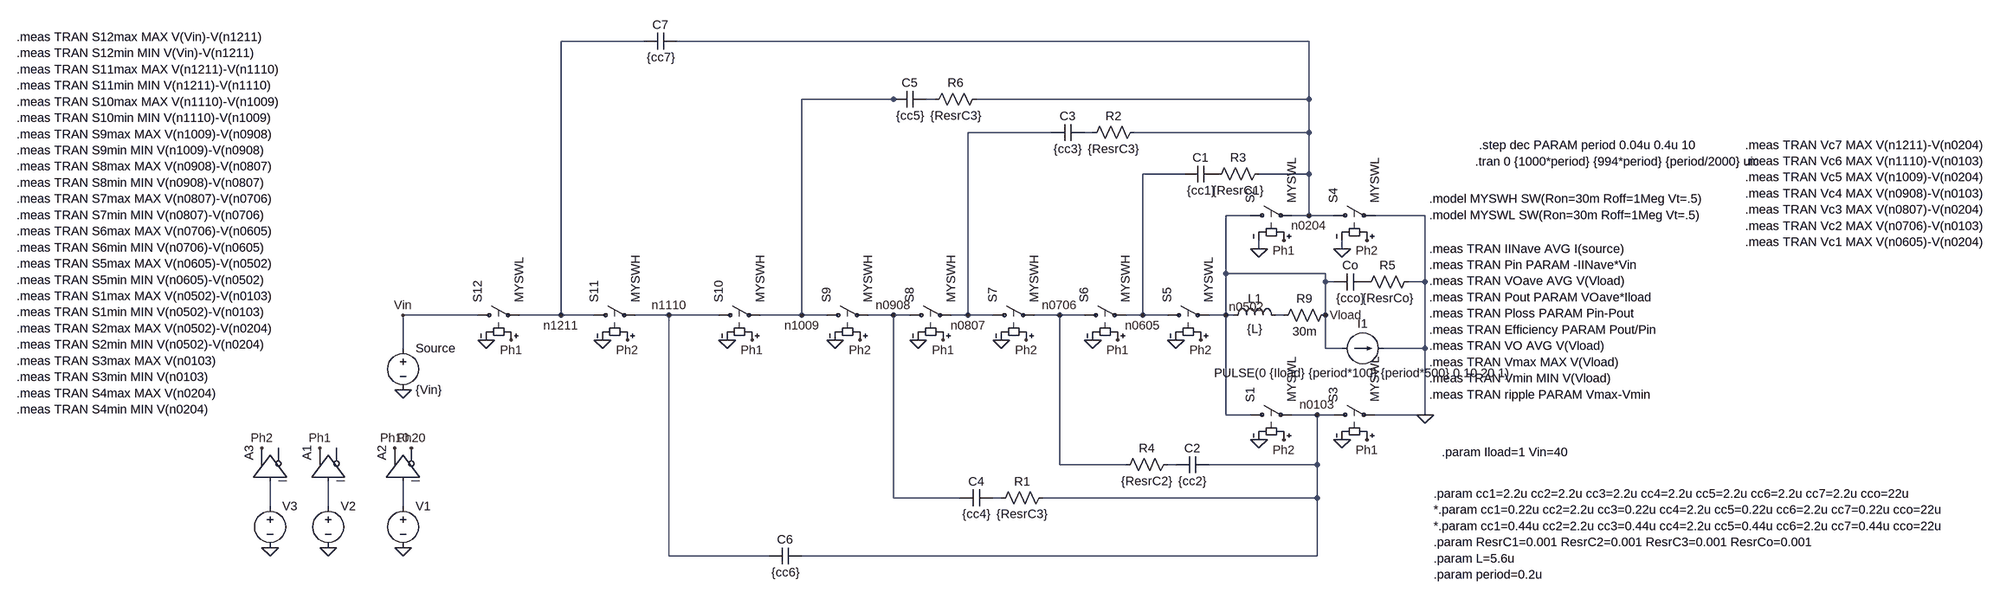
[diagram p0: schematic 8to1_dickson_two_phase.asc]
8to1_dickson_two_phase.asc, the LTspice schematic file:
Version 4
SHEET 1 1904 1156
WIRE -832 -448 -992 -448
WIRE 448 -448 -768 -448
WIRE -352 -336 -528 -336
WIRE -336 -336 -352 -336
WIRE -272 -336 -288 -336
WIRE 448 -336 448 -448
WIRE 448 -336 -192 -336
WIRE -48 -272 -208 -272
WIRE 32 -272 16 -272
WIRE 448 -272 448 -336
WIRE 448 -272 112 -272
WIRE 208 -192 128 -192
WIRE 448 -192 448 -272
WIRE 448 -192 352 -192
WIRE 336 -112 288 -112
WIRE 448 -112 448 -192
WIRE 448 -112 416 -112
WIRE 496 -112 448 -112
WIRE 672 -112 576 -112
WIRE 352 -48 352 -64
WIRE 512 -48 512 -64
WIRE 288 0 288 -112
WIRE 480 0 288 0
WIRE 480 16 480 0
WIRE 496 16 480 16
WIRE 672 16 672 -112
WIRE 672 16 640 16
WIRE -1152 80 -1296 80
WIRE -992 80 -992 -448
WIRE -992 80 -1072 80
WIRE -928 80 -992 80
WIRE -784 80 -848 80
WIRE -688 80 -784 80
WIRE -528 80 -528 -336
WIRE -528 80 -608 80
WIRE -480 80 -528 80
WIRE -352 80 -400 80
WIRE -320 80 -352 80
WIRE -208 80 -208 -272
WIRE -208 80 -240 80
WIRE -160 80 -208 80
WIRE -32 80 -80 80
WIRE 16 80 -32 80
WIRE 128 80 128 -192
WIRE 128 80 96 80
WIRE 176 80 128 80
WIRE 288 80 288 0
WIRE 288 80 256 80
WIRE 304 80 288 80
WIRE 400 80 384 80
WIRE 480 80 480 16
WIRE -1296 144 -1296 80
WIRE 480 144 480 80
WIRE 512 144 480 144
WIRE 672 144 672 16
WIRE 672 144 592 144
WIRE 288 272 288 80
WIRE 336 272 288 272
WIRE 464 272 416 272
WIRE 496 272 464 272
WIRE 672 272 672 144
WIRE 672 272 576 272
WIRE -32 368 -32 80
WIRE 96 368 -32 368
WIRE 192 368 176 368
WIRE 464 368 464 272
WIRE 464 368 256 368
WIRE -352 432 -352 80
WIRE -224 432 -352 432
WIRE -144 432 -160 432
WIRE 464 432 464 368
WIRE 464 432 -64 432
WIRE -1552 448 -1552 400
WIRE -1440 448 -1440 400
WIRE -1296 448 -1296 400
WIRE -784 544 -784 80
WIRE -592 544 -784 544
WIRE 464 544 464 432
WIRE 464 544 -528 544
FLAG -1440 528 0
FLAG -1456 336 Ph1
FLAG -1296 224 0
FLAG -256 128 Ph1
FLAG 80 128 Ph1
FLAG 400 -64 Ph1
FLAG 560 320 Ph1
FLAG -96 128 Ph2
FLAG 240 128 Ph2
FLAG 560 -64 Ph2
FLAG 400 320 Ph2
FLAG -304 128 0
FLAG -144 128 0
FLAG 32 128 0
FLAG 192 128 0
FLAG 352 -48 0
FLAG 352 320 0
FLAG 512 -48 0
FLAG 512 320 0
FLAG -1296 80 Vin
FLAG -416 128 Ph2
FLAG -464 128 0
FLAG -624 128 Ph1
FLAG -864 128 Ph2
FLAG -1088 128 Ph1
FLAG -1136 128 0
FLAG -912 128 0
FLAG -672 128 0
FLAG 480 80 Vload
FLAG 672 272 0
FLAG -1296 528 0
FLAG -1312 336 Ph10
FLAG -1280 336 Ph20
FLAG -1552 528 0
FLAG -1568 336 Ph2
FLAG -784 80 n1110
FLAG -992 80 n1211
FLAG -528 80 n1009
FLAG -352 80 n0908
FLAG -208 80 n0807
FLAG -32 80 n0706
FLAG 128 80 n0605
FLAG 288 80 n0502
FLAG 464 272 n0103
FLAG 448 -112 n0204
SYMBOL voltage -1440 432 R0
WINDOW 123 0 0 Left 2
WINDOW 39 0 0 Left 2
WINDOW 3 24 96 Invisible 2
SYMATTR Value PULSE(0 1 0 1p 1p {period/2-1p} {period})
SYMATTR InstName V2
SYMBOL Digital\\buf -1504 400 R270
SYMATTR InstName A1
SYMBOL voltage -1296 128 R0
WINDOW 123 0 0 Left 2
WINDOW 39 0 0 Left 2
SYMATTR InstName Source
SYMATTR Value {Vin}
SYMBOL sw -336 80 R270
SYMATTR InstName S8
SYMATTR Value MYSWH
SYMBOL sw -176 80 R270
SYMATTR InstName S7
SYMATTR Value MYSWH
SYMBOL sw 0 80 R270
SYMATTR InstName S6
SYMATTR Value MYSWH
SYMBOL sw 160 80 R270
SYMATTR InstName S5
SYMATTR Value MYSWL
SYMBOL sw 320 -112 R270
SYMATTR InstName S2
SYMATTR Value MYSWL
SYMBOL sw 480 -112 R270
SYMATTR InstName S4
SYMATTR Value MYSWL
SYMBOL sw 480 272 R270
SYMATTR InstName S3
SYMATTR Value MYSWL
SYMBOL sw 320 272 R270
SYMATTR InstName S1
SYMATTR Value MYSWL
SYMBOL cap -48 -256 R270
WINDOW 0 32 32 VTop 2
WINDOW 3 0 32 VBottom 2
SYMATTR InstName C3
SYMATTR Value {cc3}
SYMATTR SpiceLine ic={Vin/8*3}
SYMBOL cap 208 -176 R270
WINDOW 0 32 32 VTop 2
WINDOW 3 0 32 VBottom 2
SYMATTR InstName C1
SYMATTR Value {cc1}
SYMATTR SpiceLine ic={Vin/8*1}
SYMBOL cap 192 384 R270
WINDOW 0 32 32 VTop 2
WINDOW 3 0 32 VBottom 2
SYMATTR InstName C2
SYMATTR Value {cc2}
SYMATTR SpiceLine ic={Vin/8*2}
SYMBOL cap 496 32 R270
WINDOW 0 32 32 VTop 2
WINDOW 3 0 32 VBottom 2
SYMATTR InstName Co
SYMATTR Value {cco}
SYMBOL res 16 -256 R270
WINDOW 0 32 56 VTop 2
WINDOW 3 0 56 VBottom 2
SYMATTR InstName R2
SYMATTR Value {ResrC3}
SYMBOL res 256 -176 R270
WINDOW 0 32 56 VTop 2
WINDOW 3 0 56 VBottom 2
SYMATTR InstName R3
SYMATTR Value {ResrC1}
SYMBOL res 80 384 R270
WINDOW 0 32 56 VTop 2
WINDOW 3 0 56 VBottom 2
SYMATTR InstName R4
SYMATTR Value {ResrC2}
SYMBOL res 544 32 R270
WINDOW 0 32 56 VTop 2
WINDOW 3 0 56 VBottom 2
SYMATTR InstName R5
SYMATTR Value {ResrCo}
SYMBOL current 512 144 R270
WINDOW 0 32 40 VTop 2
WINDOW 3 -32 40 VBottom 2
WINDOW 123 0 0 Left 2
WINDOW 39 0 0 Left 2
SYMATTR InstName I1
SYMATTR Value PULSE(0 {Iload} {period*100} {period*500} 0 10 20 1)
SYMBOL cap -224 448 R270
WINDOW 0 32 32 VTop 2
WINDOW 3 0 32 VBottom 2
SYMATTR InstName C4
SYMATTR Value {cc4}
SYMATTR SpiceLine ic={Vin/8*4}
SYMBOL res -160 448 R270
WINDOW 0 32 56 VTop 2
WINDOW 3 0 56 VBottom 2
SYMATTR InstName R1
SYMATTR Value {ResrC3}
SYMBOL sw -496 80 R270
SYMATTR InstName S9
SYMATTR Value MYSWH
SYMBOL cap -352 -320 R270
WINDOW 0 32 32 VTop 2
WINDOW 3 0 32 VBottom 2
SYMATTR InstName C5
SYMATTR Value {cc5}
SYMATTR SpiceLine ic={Vin/8*5}
SYMBOL res -288 -320 R270
WINDOW 0 32 56 VTop 2
WINDOW 3 0 56 VBottom 2
SYMATTR InstName R6
SYMATTR Value {ResrC3}
SYMBOL cap -592 560 R270
WINDOW 0 32 32 VTop 2
WINDOW 3 0 32 VBottom 2
SYMATTR InstName C6
SYMATTR Value {cc6}
SYMATTR SpiceLine Rser=7m
SYMATTR SpiceLine2 ic={Vin/8*6}
SYMBOL cap -832 -432 R270
WINDOW 0 32 32 VTop 2
WINDOW 3 0 32 VBottom 2
SYMATTR InstName C7
SYMATTR Value {cc7}
SYMATTR SpiceLine Rser=7m
SYMATTR SpiceLine2 ic={Vin/8*7}
SYMBOL sw -704 80 R270
SYMATTR InstName S10
SYMATTR Value MYSWH
SYMBOL sw -944 80 R270
SYMATTR InstName S11
SYMATTR Value MYSWH
SYMBOL sw -1168 80 R270
SYMATTR InstName S12
SYMATTR Value MYSWL
SYMBOL ind 288 96 R270
WINDOW 0 32 56 VTop 2
WINDOW 3 5 56 VBottom 2
SYMATTR InstName L1
SYMATTR Value {L}
SYMATTR SpiceLine Rser=0
SYMBOL res 496 64 R90
WINDOW 0 0 56 VBottom 2
WINDOW 3 32 56 VTop 2
SYMATTR InstName R9
SYMATTR Value 30m
SYMBOL voltage -1296 432 R0
WINDOW 123 0 0 Left 2
WINDOW 39 0 0 Left 2
WINDOW 3 24 96 Invisible 2
SYMATTR Value PULSE(0 1 0 1n 1n {period/2-1n} {period})
SYMATTR InstName V1
SYMBOL Digital\\buf -1360 400 R270
SYMATTR InstName A2
SYMBOL voltage -1552 432 R0
WINDOW 123 0 0 Left 2
WINDOW 39 0 0 Left 2
WINDOW 3 24 96 Invisible 2
SYMATTR Value PULSE(0 1 {period/2} 1p 1p {period/2-1p} {period})
SYMATTR InstName V3
SYMBOL Digital\\buf -1616 400 R270
SYMATTR InstName A3
TEXT 768 -216 Left 2 !.tran 0 {1000*period} {994*period} {period/2000} uic
TEXT 680 -144 Left 2 !.model MYSWH SW(Ron=30m Roff=1Meg Vt=.5)\n.model MYSWL SW(Ron=30m Roff=1Meg Vt=.5)
TEXT 680 -48 Left 2 !.meas TRAN IINave AVG I(source)\n.meas TRAN Pin PARAM -IINave*Vin\n.meas TRAN VOave AVG V(Vload)\n.meas TRAN Pout PARAM VOave*Iload\n.meas TRAN Ploss PARAM Pin-Pout\n.meas TRAN Efficiency PARAM Pout/Pin\n.meas TRAN VO AVG V(Vload)\n.meas TRAN Vmax MAX V(Vload)\n.meas TRAN Vmin MIN V(Vload)\n.meas TRAN ripple PARAM Vmax-Vmin
TEXT 688 424 Left 2 !.param cc1=2.2u cc2=2.2u cc3=2.2u cc4=2.2u cc5=2.2u cc6=2.2u cc7=2.2u cco=22u\n*.param cc1=0.22u cc2=2.2u cc3=0.22u cc4=2.2u cc5=0.22u cc6=2.2u cc7=0.22u cco=22u\n*.param cc1=0.44u cc2=2.2u cc3=0.44u cc4=2.2u cc5=0.44u cc6=2.2u cc7=0.44u cco=22u\n.param ResrC1=0.001 ResrC2=0.001 ResrC3=0.001 ResrCo=0.001\n.param L=5.6u\n.param period=0.2u
TEXT 776 -248 Left 2 !.step dec PARAM period 0.04u 0.4u 10
TEXT 1288 -248 Left 2 !.meas TRAN Vc7 MAX V(n1211)-V(n0204)\n.meas TRAN Vc6 MAX V(n1110)-V(n0103)\n.meas TRAN Vc5 MAX V(n1009)-V(n0204)\n.meas TRAN Vc4 MAX V(n0908)-V(n0103)\n.meas TRAN Vc3 MAX V(n0807)-V(n0204)\n.meas TRAN Vc2 MAX V(n0706)-V(n0103)\n.meas TRAN Vc1 MAX V(n0605)-V(n0204)
TEXT -2040 -456 Left 2 !.meas TRAN S12max MAX V(Vin)-V(n1211)\n.meas TRAN S12min MIN V(Vin)-V(n1211)\n.meas TRAN S11max MAX V(n1211)-V(n1110)\n.meas TRAN S11min MIN V(n1211)-V(n1110)\n.meas TRAN S10max MAX V(n1110)-V(n1009)\n.meas TRAN S10min MIN V(n1110)-V(n1009)\n.meas TRAN S9max MAX V(n1009)-V(n0908)\n.meas TRAN S9min MIN V(n1009)-V(n0908)\n.meas TRAN S8max MAX V(n0908)-V(n0807)\n.meas TRAN S8min MIN V(n0908)-V(n0807)\n.meas TRAN S7max MAX V(n0807)-V(n0706)\n.meas TRAN S7min MIN V(n0807)-V(n0706)\n.meas TRAN S6max MAX V(n0706)-V(n0605)\n.meas TRAN S6min MIN V(n0706)-V(n0605)\n.meas TRAN S5max MAX V(n0605)-V(n0502)\n.meas TRAN S5min MIN V(n0605)-V(n0502)\n.meas TRAN S1max MAX V(n0502)-V(n0103)\n.meas TRAN S1min MIN V(n0502)-V(n0103)\n.meas TRAN S2max MAX V(n0502)-V(n0204)\n.meas TRAN S2min MIN V(n0502)-V(n0204)\n.meas TRAN S3max MAX V(n0103)\n.meas TRAN S3min MIN V(n0103)\n.meas TRAN S4max MAX V(n0204)\n.meas TRAN S4min MIN V(n0204)
TEXT 704 344 Left 2 !.param Iload=1 Vin=40

The netlist it stands for:
* 8to1_dickson_two_phase.asc
V2 N007 0 PULSE(0 1 0 1p 1p {period/2-1p} {period})
A1 N007 0 0 0 0 0 Ph1 0 BUF
V§Source Vin 0 {Vin}
S8 n0908 n0807 Ph1 0 MYSWH
S7 n0807 n0706 Ph2 0 MYSWH
S6 n0706 n0605 Ph1 0 MYSWH
S5 n0605 n0502 Ph2 0 MYSWL
S2 n0502 n0204 Ph1 0 MYSWL
S4 n0204 0 Ph2 0 MYSWL
S3 n0103 0 Ph1 0 MYSWL
S1 n0502 n0103 Ph2 0 MYSWL
C3 n0807 N002 {cc3} ic={Vin/8*3}
C1 n0605 P001 {cc1} ic={Vin/8*1}
C2 N004 n0103 {cc2} ic={Vin/8*2}
Co n0502 P002 {cco}
R2 N002 n0204 {ResrC3}
R3 P001 n0204 {ResrC1}
R4 n0706 N004 {ResrC2}
R5 P002 0 {ResrCo}
I1 n0502 0 PULSE(0 {Iload} {period*100} {period*500} 0 10 20 1)
C4 n0908 N005 {cc4} ic={Vin/8*4}
R1 N005 n0103 {ResrC3}
S9 n1009 n0908 Ph2 0 MYSWH
C5 n1009 N001 {cc5} ic={Vin/8*5}
R6 N001 n0204 {ResrC3}
C6 n1110 n0103 {cc6} Rser=7m ic={Vin/8*6}
C7 n1211 n0204 {cc7} Rser=7m ic={Vin/8*7}
S10 n1110 n1009 Ph1 0 MYSWH
S11 n1211 n1110 Ph2 0 MYSWH
S12 Vin n1211 Ph1 0 MYSWL
L1 n0502 N003 {L} Rser=0
R9 n0502 N003 30m
V1 N008 0 PULSE(0 1 0 1n 1n {period/2-1n} {period})
A2 N008 0 0 0 0 Ph20 Ph10 0 BUF
V3 N006 0 PULSE(0 1 {period/2} 1p 1p {period/2-1p} {period})
A3 N006 0 0 0 0 0 Ph2 0 BUF
.tran 0 {1000*period} {994*period} {period/2000} uic
.model MYSWH SW(Ron=30m Roff=1Meg Vt=.5)
.model MYSWL SW(Ron=30m Roff=1Meg Vt=.5)
.meas TRAN IINave AVG I(source)
.meas TRAN Pin PARAM -IINave*Vin
.meas TRAN VOave AVG V(Vload)
.meas TRAN Pout PARAM VOave*Iload
.meas TRAN Ploss PARAM Pin-Pout
.meas TRAN Efficiency PARAM Pout/Pin
.meas TRAN VO AVG V(Vload)
.meas TRAN Vmax MAX V(Vload)
.meas TRAN Vmin MIN V(Vload)
.meas TRAN ripple PARAM Vmax-Vmin
.param cc1=2.2u cc2=2.2u cc3=2.2u cc4=2.2u cc5=2.2u cc6=2.2u cc7=2.2u cco=22u
*.param cc1=0.22u cc2=2.2u cc3=0.22u cc4=2.2u cc5=0.22u cc6=2.2u cc7=0.22u cco=22u
*.param cc1=0.44u cc2=2.2u cc3=0.44u cc4=2.2u cc5=0.44u cc6=2.2u cc7=0.44u cco=22u
.param ResrC1=0.001 ResrC2=0.001 ResrC3=0.001 ResrCo=0.001
.param L=5.6u
.param period=0.2u
.step dec PARAM period 0.04u 0.4u 10
.meas TRAN Vc7 MAX V(n1211)-V(n0204)
.meas TRAN Vc6 MAX V(n1110)-V(n0103)
.meas TRAN Vc5 MAX V(n1009)-V(n0204)
.meas TRAN Vc4 MAX V(n0908)-V(n0103)
.meas TRAN Vc3 MAX V(n0807)-V(n0204)
.meas TRAN Vc2 MAX V(n0706)-V(n0103)
.meas TRAN Vc1 MAX V(n0605)-V(n0204)
.meas TRAN S12max MAX V(Vin)-V(n1211)
.meas TRAN S12min MIN V(Vin)-V(n1211)
.meas TRAN S11max MAX V(n1211)-V(n1110)
.meas TRAN S11min MIN V(n1211)-V(n1110)
.meas TRAN S10max MAX V(n1110)-V(n1009)
.meas TRAN S10min MIN V(n1110)-V(n1009)
.meas TRAN S9max MAX V(n1009)-V(n0908)
.meas TRAN S9min MIN V(n1009)-V(n0908)
.meas TRAN S8max MAX V(n0908)-V(n0807)
.meas TRAN S8min MIN V(n0908)-V(n0807)
.meas TRAN S7max MAX V(n0807)-V(n0706)
.meas TRAN S7min MIN V(n0807)-V(n0706)
.meas TRAN S6max MAX V(n0706)-V(n0605)
.meas TRAN S6min MIN V(n0706)-V(n0605)
.meas TRAN S5max MAX V(n0605)-V(n0502)
.meas TRAN S5min MIN V(n0605)-V(n0502)
.meas TRAN S1max MAX V(n0502)-V(n0103)
.meas TRAN S1min MIN V(n0502)-V(n0103)
.meas TRAN S2max MAX V(n0502)-V(n0204)
.meas TRAN S2min MIN V(n0502)-V(n0204)
.meas TRAN S3max MAX V(n0103)
.meas TRAN S3min MIN V(n0103)
.meas TRAN S4max MAX V(n0204)
.meas TRAN S4min MIN V(n0204)
.param Iload=1 Vin=40
.backanno
.end